# Altium schematic sheet 12V_TO_5V_DC.SchDoc
size A; SheetNumber: 28; SheetTotal: 28
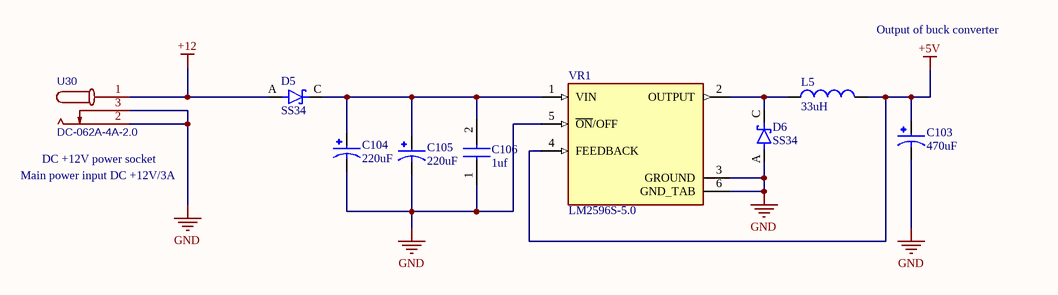
[diagram p0: 12V_TO_5V_DC.SchDoc]

## Parts
C103  470uF  [Plugin,6.3x8mm]
C104  220uF  [Plugin,6.3x8mm]
C105  220uF  [Plugin,6.3x8mm]
C106  1uf  [C0805]
D5  SS34  [SMA]
D6  SS34  [SMA]
L5  33uH  [Inductor]
U30  DC-062A-4A-2.0  [Plugin]
VR1  LM2596S-5.0  [TO-263-5]

## Nets
+5V: C103.1 L5.2 VR1.4(FEEDBACK)
+12: D5.A U30.1
GND: C103.2 C104.2 C105.2 C106.1(C1) D6.A U30.2 U30.3 VR1.3(GROUND) VR1.5(~{ON}/OFF) VR1.6(GND_TAB)
NetC104_1: C104.1 C105.1 C106.2(C2) D5.C(K) VR1.1(VIN)
NetD6_C: D6.C(K) L5.1 VR1.2(OUTPUT)

## Notes on the sheet
- Output of buck converter
- (near U30) Main power input DC +12V/3A
- (near U30) DC +12V power socket

## Library data of the parts
C103 = SPTOJM471E08OR: 6.3V 470uF ±20% Plugin,6.3x8mm Solid Capacitors ROHS; MPN: EEE-HC1H101P; Manufacturer: Panasonic; Package Reference: RADIAL-2 Panasonic; Value: *
C104 C105 = SPZ1CM221E08O00RAXXX: 16V 220uF ±20% 20mΩ@100kHz 2.7A@100kHz Plugin,6.3x8mm Solid Capacitors ROHS; MPN: EEE-HC1H101P; Manufacturer: Panasonic; Package Reference: RADIAL-2 Panasonic; Value: *
C106 = CL21B105KBFNNNE: 50V 1uF X7R ±10% 0805 Multilayer Ceramic Capacitors MLCC - SMD/SMT ROHS; Manufacturer: KEMET; MPN: CC0603JRNPO9BN180
D5 D6 = SS34: Diode Schottky 40V 3A 2-Pin SMC T/R; Value: *
  D5: Price: None; MP: SS34; Availability: Unavailable; Package: None
  D6: MPN: SS34; Package Reference: None
L5 = SLH1207S330MTT: 3A 33uH ±20% 64.8mΩ SMD Power Inductors ROHS; MPN: AIML-0805HC-100M-T; Manufacturer: Abracon; Package Reference: 2012 Abracon; Value: *
VR1 = LM2596S-5.0: Step-down type Fixed 40V~40V 5V 3A TO-263-5 DC-DC Converters ROHS; Value: *; Package Reference: None; MPN: LM2596S-5.0
U30 = DC-062A-4A-2.0: LCSC: C5147479; MPN: DC-062A-4A-2.0